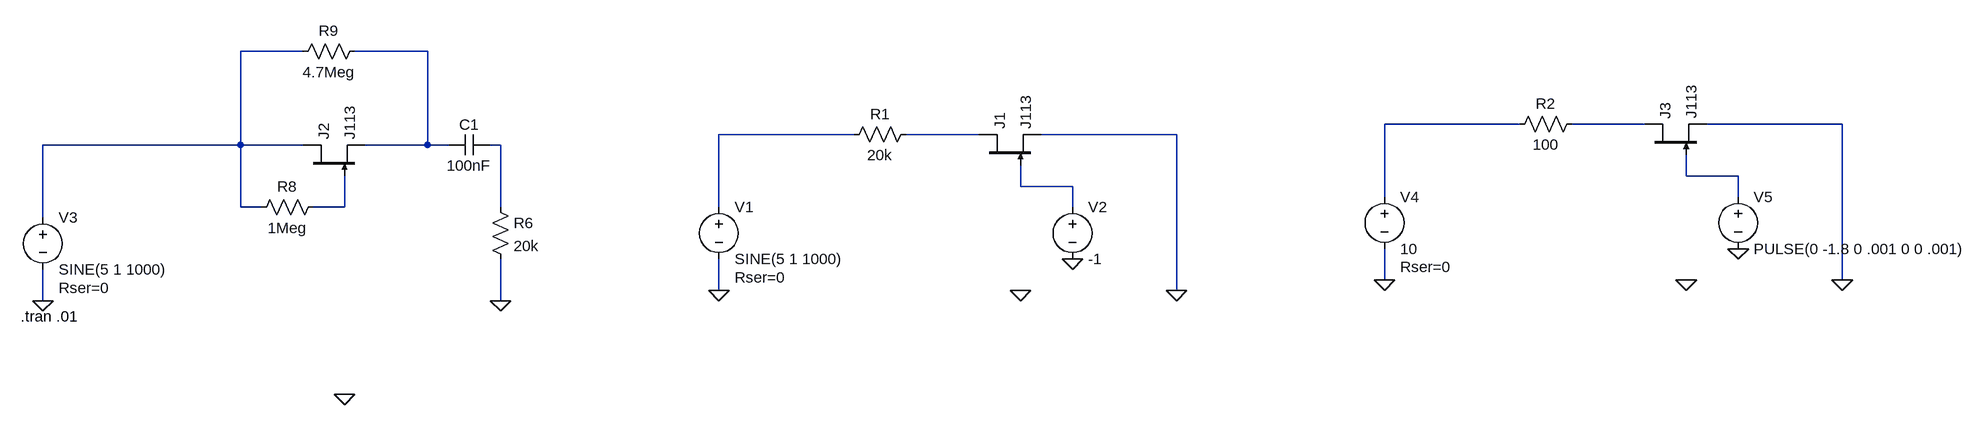
[diagram p0: schematic jfet switch.asc]
jfet switch.asc, the LTspice schematic file:
Version 4
SHEET 1 1812 868
WIRE -1360 128 -1456 128
WIRE -1168 128 -1280 128
WIRE 512 240 304 240
WIRE 704 240 592 240
WIRE 1008 240 800 240
WIRE -512 256 -720 256
WIRE -320 256 -432 256
WIRE -16 256 -224 256
WIRE -1456 272 -1456 128
WIRE -1456 272 -1760 272
WIRE -1360 272 -1456 272
WIRE -1168 272 -1168 128
WIRE -1168 272 -1264 272
WIRE -1136 272 -1168 272
WIRE -1056 272 -1072 272
WIRE 768 320 768 288
WIRE 848 320 768 320
WIRE -256 336 -256 304
WIRE -176 336 -256 336
WIRE 304 352 304 240
WIRE 848 352 848 320
WIRE -1456 368 -1456 272
WIRE -1424 368 -1456 368
WIRE -1296 368 -1296 320
WIRE -1296 368 -1344 368
WIRE -1056 368 -1056 272
WIRE -720 368 -720 256
WIRE -176 368 -176 336
WIRE -1760 384 -1760 272
WIRE 304 480 304 432
WIRE 1008 480 1008 240
WIRE -720 496 -720 448
WIRE -16 496 -16 256
WIRE -1760 512 -1760 464
WIRE -1056 512 -1056 448
FLAG -1760 512 0
FLAG -1056 512 0
FLAG -1296 656 0
FLAG -720 496 0
FLAG -16 496 0
FLAG -256 496 0
FLAG -176 448 0
FLAG 304 480 0
FLAG 1008 480 0
FLAG 768 480 0
FLAG 848 432 0
SYMBOL voltage -1760 368 R0
WINDOW 123 0 0 Left 0
WINDOW 39 24 124 Left 2
SYMATTR SpiceLine Rser=0
SYMATTR InstName V3
SYMATTR Value SINE(5 1 1000)
SYMBOL njf -1360 320 R270
SYMATTR InstName J2
SYMATTR Value J113
SYMBOL res -1072 352 R0
SYMATTR InstName R6
SYMATTR Value 20k
SYMBOL res -1328 352 R90
WINDOW 0 0 56 VBottom 2
WINDOW 3 32 56 VTop 2
SYMATTR InstName R8
SYMATTR Value 1Meg
SYMBOL res -1264 112 R90
WINDOW 0 0 56 VBottom 2
WINDOW 3 32 56 VTop 2
SYMATTR InstName R9
SYMATTR Value 4.7Meg
SYMBOL cap -1072 256 R90
WINDOW 0 0 32 VBottom 2
WINDOW 3 32 32 VTop 2
SYMATTR InstName C1
SYMATTR Value 100nF
SYMBOL voltage -720 352 R0
WINDOW 123 0 0 Left 0
WINDOW 39 24 124 Left 2
SYMATTR SpiceLine Rser=0
SYMATTR InstName V1
SYMATTR Value SINE(5 1 1000)
SYMBOL njf -320 304 R270
SYMATTR InstName J1
SYMATTR Value J113
SYMBOL res -416 240 R90
WINDOW 0 0 56 VBottom 2
WINDOW 3 32 56 VTop 2
SYMATTR InstName R1
SYMATTR Value 20k
SYMBOL voltage -176 352 R0
WINDOW 123 0 0 Left 0
WINDOW 39 0 0 Left 0
SYMATTR InstName V2
SYMATTR Value -1
SYMBOL voltage 304 336 R0
WINDOW 123 0 0 Left 0
WINDOW 39 24 124 Left 2
SYMATTR SpiceLine Rser=0
SYMATTR InstName V4
SYMATTR Value 10
SYMBOL njf 704 288 R270
SYMATTR InstName J3
SYMATTR Value J113
SYMBOL res 608 224 R90
WINDOW 0 0 56 VBottom 2
WINDOW 3 32 56 VTop 2
SYMATTR InstName R2
SYMATTR Value 100
SYMBOL voltage 848 336 R0
WINDOW 123 0 0 Left 0
WINDOW 39 0 0 Left 0
SYMATTR InstName V5
SYMATTR Value PULSE(0 -1.8 0 .001 0 0 .001)
TEXT -1794 536 Left 2 !.tran .01

The netlist it stands for:
* jfet switch.asc
V3 N001 0 SINE(5 1 1000) Rser=0
J2 N001 N010 N002 J113
R6 N007 0 20k
R8 N010 N001 1Meg
R9 N002 N001 4.7Meg
C1 N007 N002 100nF
V1 N005 0 SINE(5 1 1000) Rser=0
J1 N006 N009 0 J113
R1 N006 N005 20k
V2 N009 0 -1
V4 N003 0 10 Rser=0
J3 N004 N008 0 J113
R2 N004 N003 100
V5 N008 0 PULSE(0 -1.8 0 .001 0 0 .001)
.model NJF NJF
.model PJF PJF
.lib standard.jft
.tran .01
.backanno
.end